# Altium schematic sheet Drivers.SchDoc: Drivers
size Letter; Date: 2015-12-16; Revision: 5; SheetNumber: 3; SheetTotal: 4; ProjectTitle: Power Distribution Unit
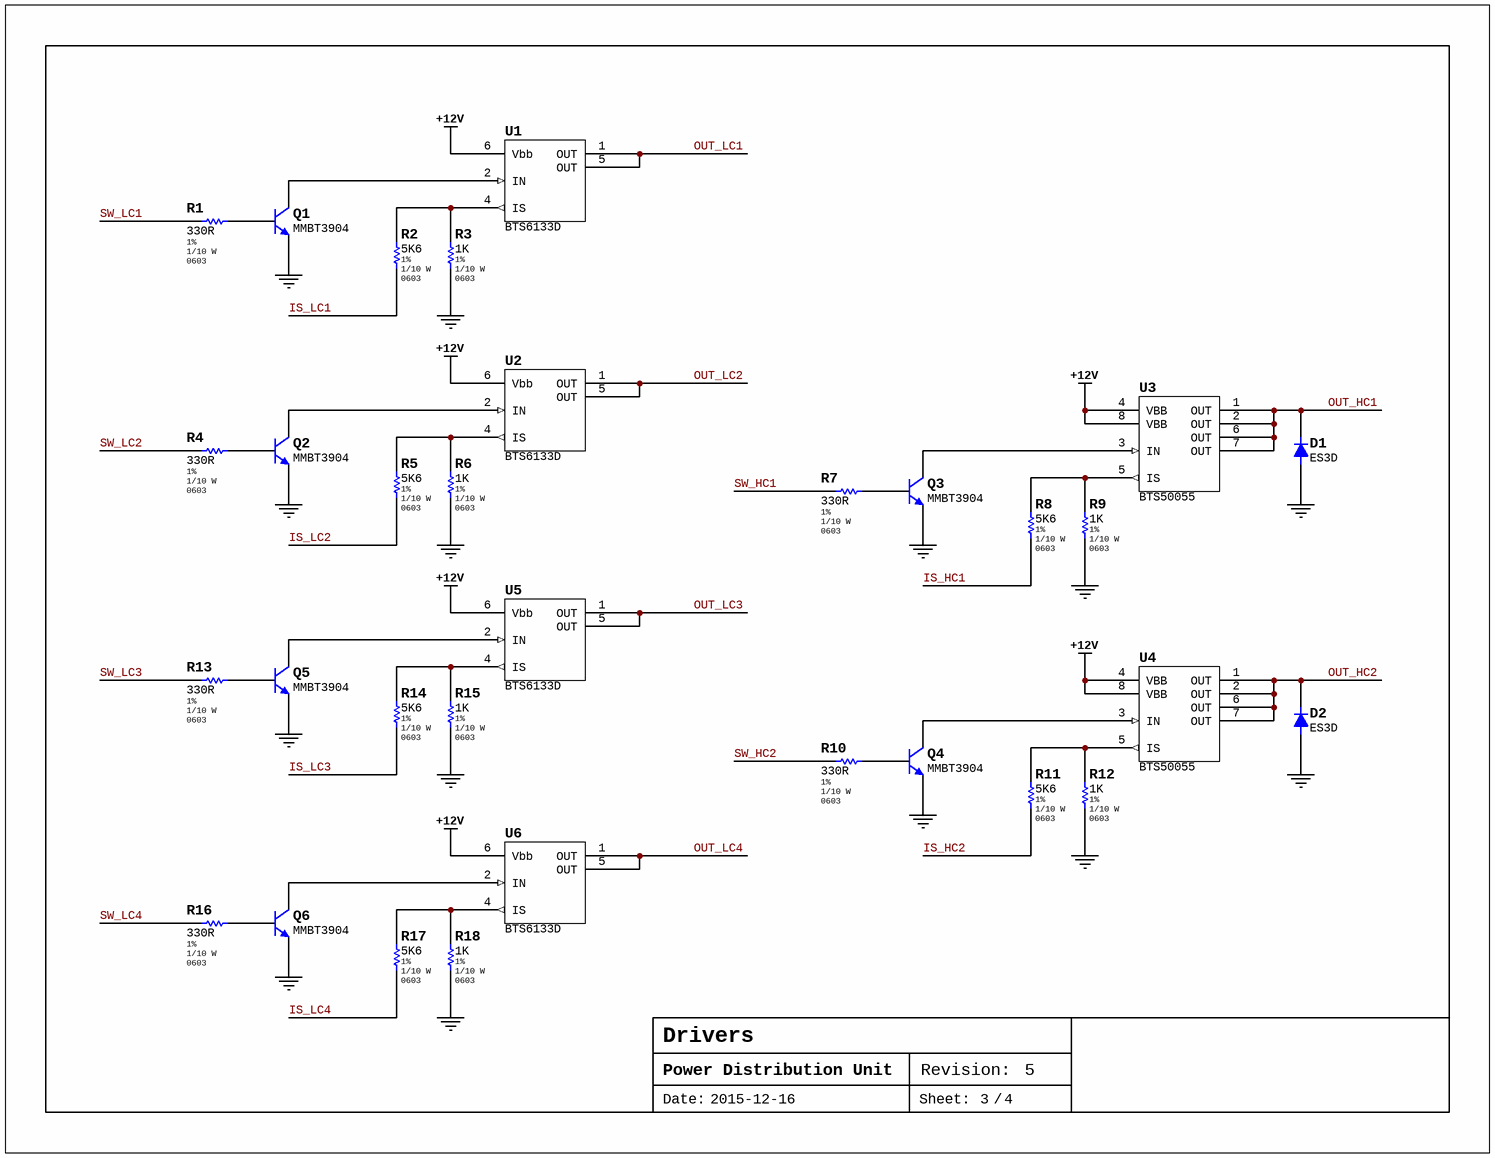
[diagram p0: Drivers.SchDoc]

## Parts
D1  ES3D  [DIOM6959X26M]
D2  ES3D  [DIOM6959X26M]
Q1  MMBT3904  [SOT23-3]
Q2  MMBT3904  [SOT23-3]
Q3  MMBT3904  [SOT23-3]
Q4  MMBT3904  [SOT23-3]
Q5  MMBT3904  [SOT23-3]
Q6  MMBT3904  [SOT23-3]
R1  330R  Tolerance: 1%  Power: 1/10 W  Package: 0603  [RES-0603-M]
R2  5K6  Tolerance: 1%  Power: 1/10 W  Package: 0603  [RES-0603-M]
R3  1K  Tolerance: 1%  Power: 1/10 W  Package: 0603  [RES-0603-M]
R4  330R  Tolerance: 1%  Power: 1/10 W  Package: 0603  [RES-0603-M]
R5  5K6  Tolerance: 1%  Power: 1/10 W  Package: 0603  [RES-0603-M]
R6  1K  Tolerance: 1%  Power: 1/10 W  Package: 0603  [RES-0603-M]
R7  330R  Tolerance: 1%  Power: 1/10 W  Package: 0603  [RES-0603-M]
R8  5K6  Tolerance: 1%  Power: 1/10 W  Package: 0603  [RES-0603-M]
R9  1K  Tolerance: 1%  Power: 1/10 W  Package: 0603  [RES-0603-M]
R10  330R  Tolerance: 1%  Power: 1/10 W  Package: 0603  [RES-0603-M]
R11  5K6  Tolerance: 1%  Power: 1/10 W  Package: 0603  [RES-0603-M]
R12  1K  Tolerance: 1%  Power: 1/10 W  Package: 0603  [RES-0603-M]
R13  330R  Tolerance: 1%  Power: 1/10 W  Package: 0603  [RES-0603-M]
R14  5K6  Tolerance: 1%  Power: 1/10 W  Package: 0603  [RES-0603-M]
R15  1K  Tolerance: 1%  Power: 1/10 W  Package: 0603  [RES-0603-M]
R16  330R  Tolerance: 1%  Power: 1/10 W  Package: 0603  [RES-0603-M]
R17  5K6  Tolerance: 1%  Power: 1/10 W  Package: 0603  [RES-0603-M]
R18  1K  Tolerance: 1%  Power: 1/10 W  Package: 0603  [RES-0603-M]
U1  BTS6133D  [PG-TO220-5-11]
U2  BTS6133D  [PG-TO220-5-11]
U3  BTS50055  [P/PG-TO220-7-4]
U4  BTS50055  [P/PG-TO220-7-4]
U5  BTS6133D  [PG-TO220-5-11]
U6  BTS6133D  [PG-TO220-5-11]

## Nets
+12V: U1.6(Vbb) U2.6(Vbb) U3.4(VBB) U3.8(VBB) U4.4(VBB) U4.8(VBB) U5.6(Vbb) U6.6(Vbb)
GND: D1.2(A) D2.2(A) Q1.2(E) Q2.2(E) Q3.2(E) Q4.2(E) Q5.2(E) Q6.2(E) R3.1 R6.1 R9.1 R12.1 R15.1 R18.1
IS_HC1: R8.1
IS_HC2: R11.1
IS_LC1: R2.1
IS_LC2: R5.1
IS_LC3: R14.1
IS_LC4: R17.1
OUT_HC1: D1.1(K) U3.1(OUT) U3.2(OUT) U3.6(OUT) U3.7(OUT)
OUT_HC2: D2.1(K) U4.1(OUT) U4.2(OUT) U4.6(OUT) U4.7(OUT)
OUT_LC1: U1.1(OUT) U1.5(OUT)
OUT_LC2: U2.1(OUT) U2.5(OUT)
OUT_LC3: U5.1(OUT) U5.5(OUT)
OUT_LC4: U6.1(OUT) U6.5(OUT)
SW_HC1: R7.1
SW_HC2: R10.1
SW_LC1: R1.1
SW_LC2: R4.1
SW_LC3: R13.1
SW_LC4: R16.1
NetQ1_1: Q1.1(B) R1.2
NetQ1_3: Q1.3(C) U1.2(IN)
NetQ2_1: Q2.1(B) R4.2
NetQ2_3: Q2.3(C) U2.2(IN)
NetQ3_1: Q3.1(B) R7.2
NetQ3_3: Q3.3(C) U3.3(IN)
NetQ4_1: Q4.1(B) R10.2
NetQ4_3: Q4.3(C) U4.3(IN)
NetQ5_1: Q5.1(B) R13.2
NetQ5_3: Q5.3(C) U5.2(IN)
NetQ6_1: Q6.1(B) R16.2
NetQ6_3: Q6.3(C) U6.2(IN)
NetR2_2: R2.2 R3.2 U1.4(IS)
NetR5_2: R5.2 R6.2 U2.4(IS)
NetR8_2: R8.2 R9.2 U3.5(IS)
NetR11_2: R11.2 R12.2 U4.5(IS)
NetR14_2: R14.2 R15.2 U5.4(IS)
NetR17_2: R17.2 R18.2 U6.4(IS)

## Notes on the sheet
- Date:
- Sheet:
- Revision:
- /

## Library data of the parts
R1 R4 R7 R10 R13 R16 = RC0603FR-07330RL: Manufacturer: Yageo; Manufacturer Series: RC; Temperature Coefficient: ±100ppm/°C; Part Number: RC0603FR-07330RL; Component Type: Standard; Value: 330R; Temperature Range: -55°C ~ 155°C; Supplier 1: Digi-Key; Supplier Part Number 1: 311-330HRCT-ND
R2 R5 R8 R11 R14 R17 = RC0603FR-075K6L: Manufacturer: Yageo; Manufacturer Series: RC; Temperature Coefficient: ±100ppm/°C; Part Number: RC0603FR-075K6L; Component Type: Standard; Value: 5K6; Temperature Range: -55°C ~ 155°C; Supplier 1: Digi-Key; Supplier Part Number 1: 311-5.60KHRCT-ND
R3 R6 R9 R12 R15 R18 = RC0603FR-071KL: Manufacturer: Yageo; Manufacturer Series: RC; Temperature Coefficient: ±100ppm/°C; Part Number: RC0603FR-071KL; Component Type: Standard; Value: 1K; Temperature Range: -55°C ~ 155°C; Supplier 1: Digi-Key; Supplier Part Number 1: 311-1.00KHRCT-ND
D1 D2 = ES3D: Supplier 1: Mouser; Supplier Part Number 1: 512-ES3D
Q1-Q6 = MMBT3904: Supplier 1: Digi-Key; Supplier Part Number 1: MMBT3904LT1GOSCT-ND
U1 U2 U5 U6 = BTS6133D: Supplier 1: Digi-Key; Supplier Part Number 1: BTS6133DCT-ND
U3 U4 = BTS50055: Supplier 1: Digi-Key; Supplier Part Number 1: BTS50055-1TMACT-ND